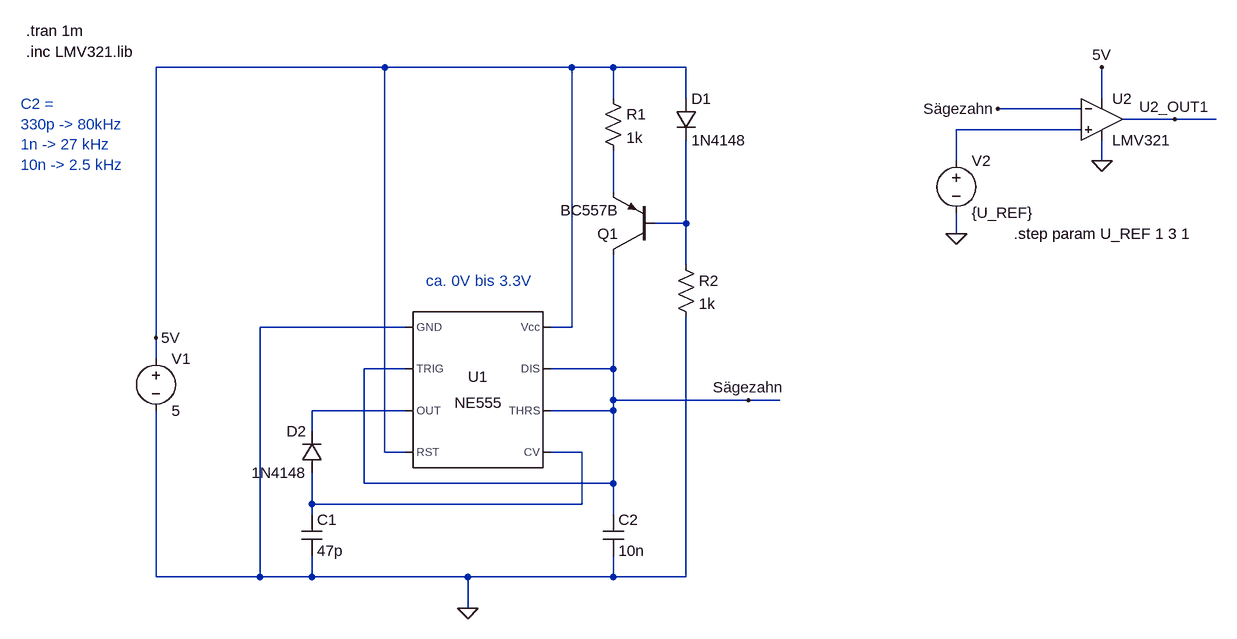
[diagram p0: schematic NE555_Sägezahn.asc]
NE555_Sägezahn.asc, the LTspice schematic file:
Version 4
SHEET 1 2040 884
WIRE 112 -336 -240 -336
WIRE 400 -336 112 -336
WIRE 464 -336 400 -336
WIRE 576 -336 464 -336
WIRE 464 -288 464 -336
WIRE 576 -288 576 -336
WIRE 1216 -288 1216 -336
WIRE 1184 -272 1056 -272
WIRE 1328 -256 1248 -256
WIRE 1392 -256 1328 -256
WIRE 1184 -240 992 -240
WIRE 992 -192 992 -240
WIRE 1216 -192 1216 -224
WIRE 464 -144 464 -208
WIRE 576 -96 576 -224
WIRE 576 -96 528 -96
WIRE 992 -80 992 -112
WIRE 576 -32 576 -96
WIRE 144 64 -80 64
WIRE 400 64 400 -336
WIRE 400 64 368 64
WIRE -240 80 -240 -336
WIRE -240 112 -240 80
WIRE 144 128 80 128
WIRE 464 128 464 -48
WIRE 464 128 368 128
WIRE 464 176 464 128
WIRE 672 176 464 176
WIRE 720 176 672 176
WIRE 144 192 0 192
WIRE 464 192 464 176
WIRE 464 192 368 192
WIRE 0 224 0 192
WIRE 112 256 112 -336
WIRE 144 256 112 256
WIRE 416 256 368 256
WIRE 80 304 80 128
WIRE 464 304 464 192
WIRE 464 304 80 304
WIRE 0 336 0 288
WIRE 416 336 416 256
WIRE 416 336 0 336
WIRE 0 352 0 336
WIRE 464 352 464 304
WIRE -240 448 -240 192
WIRE -80 448 -80 64
WIRE -80 448 -240 448
WIRE 0 448 0 416
WIRE 0 448 -80 448
WIRE 240 448 0 448
WIRE 464 448 464 416
WIRE 464 448 240 448
WIRE 576 448 576 48
WIRE 576 448 464 448
WIRE 240 496 240 448
FLAG 240 496 0
FLAG 1056 -272 Sägezahn
FLAG 992 -80 0
FLAG 1328 -256 U2_OUT1
FLAG 672 176 Sägezahn
FLAG 1216 -192 0
FLAG 1216 -336 5V
FLAG -240 80 5V
SYMBOL Misc\\NE555 256 160 R0
SYMATTR InstName U1
SYMBOL voltage -240 96 R0
WINDOW 123 0 0 Left 2
WINDOW 39 0 0 Left 2
SYMATTR InstName V1
SYMATTR Value 5
SYMBOL pnp 528 -48 R180
SYMATTR InstName Q1
SYMATTR Value BC557B
SYMBOL res 448 -304 R0
SYMATTR InstName R1
SYMATTR Value 1k
SYMBOL res 560 -48 R0
SYMATTR InstName R2
SYMATTR Value 1k
SYMBOL diode 560 -288 R0
SYMATTR InstName D1
SYMATTR Value 1N4148
SYMBOL diode 16 288 R180
WINDOW 0 24 64 Left 2
WINDOW 3 24 0 Left 2
SYMATTR InstName D2
SYMATTR Value 1N4148
SYMBOL cap -16 352 R0
SYMATTR InstName C1
SYMATTR Value 47p
SYMBOL cap 448 352 R0
SYMATTR InstName C2
SYMATTR Value 10n
SYMBOL voltage 992 -208 R0
WINDOW 123 0 0 Left 2
WINDOW 39 0 0 Left 2
SYMATTR InstName V2
SYMATTR Value {U_REF}
SYMBOL Opamps\\opamp2 1216 -320 R0
SYMATTR InstName U2
SYMATTR Value LMV321
TEXT -440 -392 Left 2 !.tran 1m
TEXT 176 -8 Left 2 ;ca. 0V bis 3.3V
TEXT -448 -280 Left 2 ;C2 =\n330p -> 80kHz\n1n -> 27 kHz\n10n -> 2.5 kHz
TEXT -440 -360 Left 2 !.inc LMV321.lib
TEXT 1080 -80 Left 2 !.step param U_REF 1 3 1

The netlist it stands for:
* NE555_Sägezahn.asc
XU1 0 Sägezahn N004 5V N005 Sägezahn Sägezahn 5V NE555  ; pins GND TRIG OUT RST CV THRS DIS Vcc
V1 5V 0 5
Q1 Sägezahn N003 N002 0 BC557B
R1 5V N002 1k
R2 N003 0 1k
D1 5V N003 1N4148
D2 N005 N004 1N4148
C1 N005 0 47p
C2 Sägezahn 0 10n
V2 N001 0 {U_REF}
XU2 N001 Sägezahn 5V 0 U2_OUT1 LMV321  ; pins In+ In- V+ V- OUT
.model D D
.lib standard.dio
.model NPN NPN
.model PNP PNP
.lib standard.bjt
.tran 1m
* ca. 0V bis 3.3V
* C2 =
* 330p -> 80kHz
* 1n -> 27 kHz
* 10n -> 2.5 kHz
.inc LMV321.lib
.step param U_REF 1 3 1
.lib NE555.sub
.backanno
.end